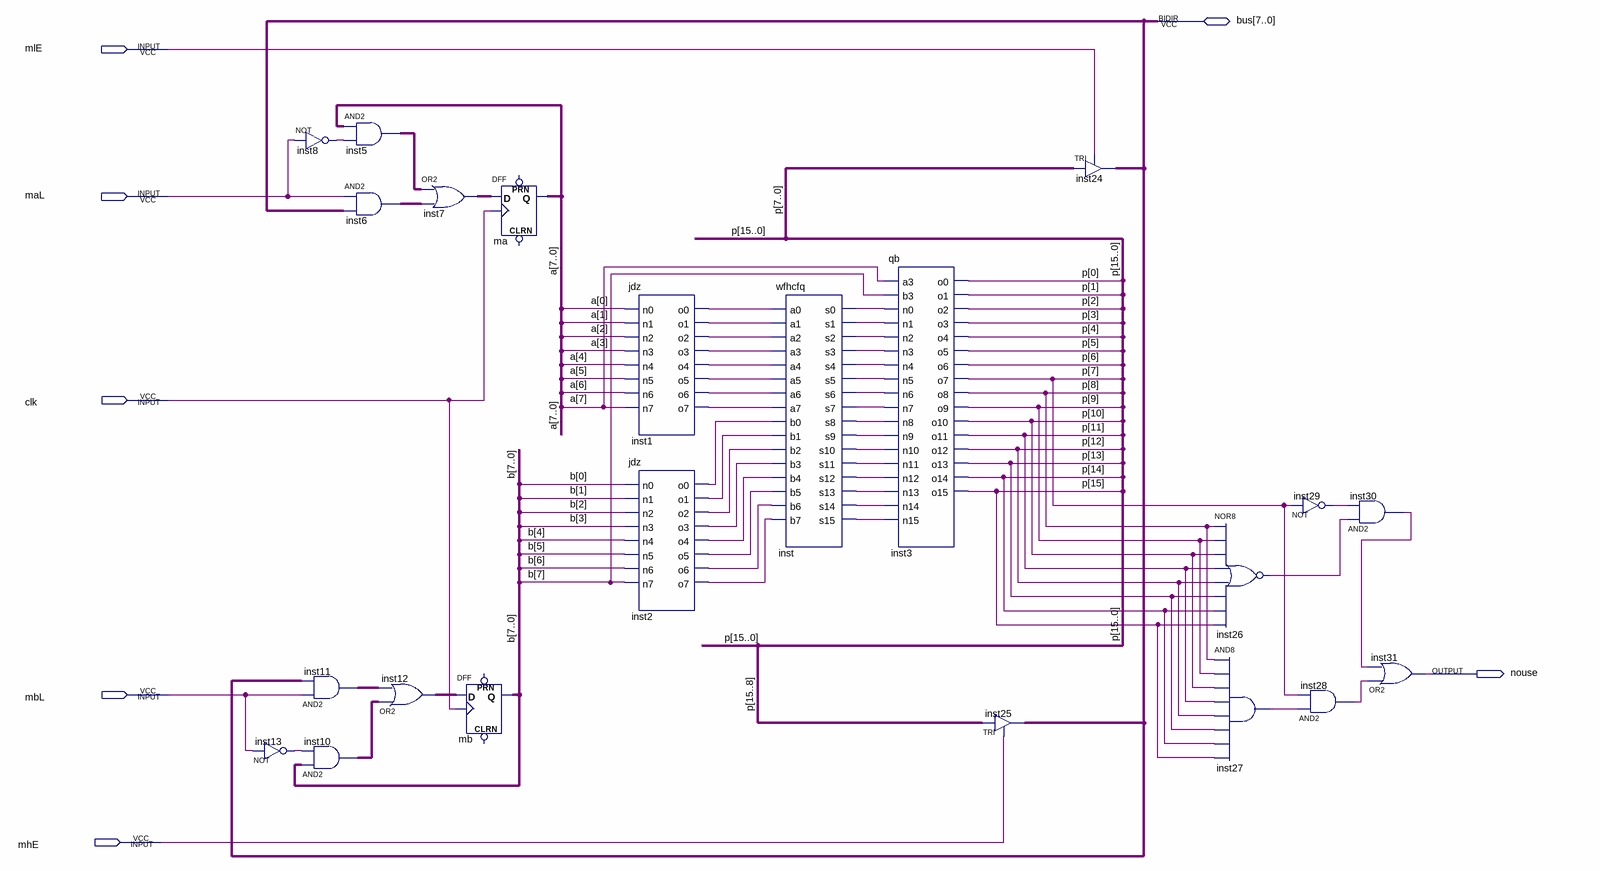
[diagram p0: schematic sheet]
// Quartus schematic mult.bdf as structural Verilog: 22 symbols, 7 pins
module mult (
  input  mlE,
  input  maL,
  input  clk,
  input  mbL,
  input  mhE,
  inout  [7:0] bus,
  output nouse
);

  wire inst1_o0, inst1_o1, inst1_o2, inst1_o3, inst1_o4, inst1_o5, inst1_o6, inst1_o7, inst2_o0, inst2_o1,
       inst2_o2, inst2_o3, inst2_o4, inst2_o5, inst2_o6, inst2_o7, inst8_out, inst13_out, inst26_out,
       inst27_out, inst28_out, inst29_out, inst30_out, inst_s0, inst_s1, inst_s2, inst_s3, inst_s4, inst_s5,
       inst_s6, inst_s7, inst_s8, inst_s9, inst_s10, inst_s11, inst_s12, inst_s13, inst_s14, inst_s15;
  wire [7:0] a, b, inst5_out, inst6_out, inst7_out, inst10_out, inst11_out, inst12_out;
  wire [15:0] p;

  not inst8 (inst8_out, maL);
  assign inst11_out = {8{mbL}} & bus;  // AND2 inst11, 8 bits wide
  assign inst10_out = b & {8{inst13_out}};  // AND2 inst10, 8 bits wide
  not inst13 (inst13_out, mbL);
  assign inst5_out = a & {8{inst8_out}};  // AND2 inst5, 8 bits wide
  assign inst6_out = {8{maL}} & bus;  // AND2 inst6, 8 bits wide
  assign inst12_out = inst10_out | inst11_out;  // OR2 inst12, 8 bits wide
  assign inst7_out = inst5_out | inst6_out;  // OR2 inst7, 8 bits wide
  DFF mb[7:0] (.CLK(clk), .D(inst12_out), .Q(b));  // open: CLRN, PRN
  DFF ma[7:0] (.CLK(clk), .D(inst7_out), .Q(a));  // open: CLRN, PRN
  jdz inst1 (
    .n0(a[0]), .n1(a[1]), .n2(a[2]), .n3(a[3]), .n4(a[4]), .n5(a[5]), .n6(a[6]), .n7(a[7]), .o0(inst1_o0),
    .o1(inst1_o1), .o2(inst1_o2), .o3(inst1_o3), .o4(inst1_o4), .o5(inst1_o5), .o6(inst1_o6), .o7(inst1_o7));
  jdz inst2 (
    .n0(b[0]), .n1(b[1]), .n2(b[2]), .n3(b[3]), .n4(b[4]), .n5(b[5]), .n6(b[6]), .n7(b[7]), .o0(inst2_o0),
    .o1(inst2_o1), .o2(inst2_o2), .o3(inst2_o3), .o4(inst2_o4), .o5(inst2_o5), .o6(inst2_o6), .o7(inst2_o7));
  wfhcfq inst (
    .a0(inst1_o0), .a1(inst1_o1), .a2(inst1_o2), .a3(inst1_o3), .a4(inst1_o4), .a5(inst1_o5), .a6(inst1_o6),
    .a7(inst1_o7), .b0(inst2_o0), .b1(inst2_o1), .b2(inst2_o2), .b3(inst2_o3), .b4(inst2_o4), .b5(inst2_o5),
    .b6(inst2_o6), .b7(inst2_o7), .s0(inst_s0), .s1(inst_s1), .s2(inst_s2), .s3(inst_s3), .s4(inst_s4),
    .s5(inst_s5), .s6(inst_s6), .s7(inst_s7), .s8(inst_s8), .s9(inst_s9), .s10(inst_s10), .s11(inst_s11),
    .s12(inst_s12), .s13(inst_s13), .s14(inst_s14), .s15(inst_s15));
  qb inst3 (
    .a3(a[7]), .b3(b[7]), .n0(inst_s0), .n1(inst_s1), .n2(inst_s2), .n3(inst_s3), .n4(inst_s4), .n5(inst_s5),
    .n6(inst_s6), .n7(inst_s7), .n8(inst_s8), .n9(inst_s9), .n10(inst_s10), .n11(inst_s11), .n12(inst_s12),
    .n13(inst_s13), .n14(inst_s14), .n15(inst_s15), .o0(p[0]), .o1(p[1]), .o2(p[2]), .o3(p[3]), .o4(p[4]),
    .o5(p[5]), .o6(p[6]), .o7(p[7]), .o8(p[8]), .o9(p[9]), .o10(p[10]), .o11(p[11]), .o12(p[12]),
    .o13(p[13]), .o14(p[14]), .o15(p[15]));
  TRI inst25[7:0] (.IN(p[15:8]), .OE(mhE), .OUT(bus));
  TRI inst24[7:0] (.IN(p[7:0]), .OE(mlE), .OUT(bus));
  nor inst26 (inst26_out, p[8], p[9], p[10], p[11], p[12], p[13], p[14], p[15]);
  and inst27 (inst27_out, p[8], p[9], p[10], p[11], p[12], p[13], p[14], p[15]);
  not inst29 (inst29_out, p[7]);
  and inst28 (inst28_out, inst27_out, p[7]);
  and inst30 (inst30_out, inst26_out, inst29_out);
  or inst31 (nouse, inst28_out, inst30_out);
endmodule
